# EAGLE schematic generic_midi_1 (EAGLE 6.4)
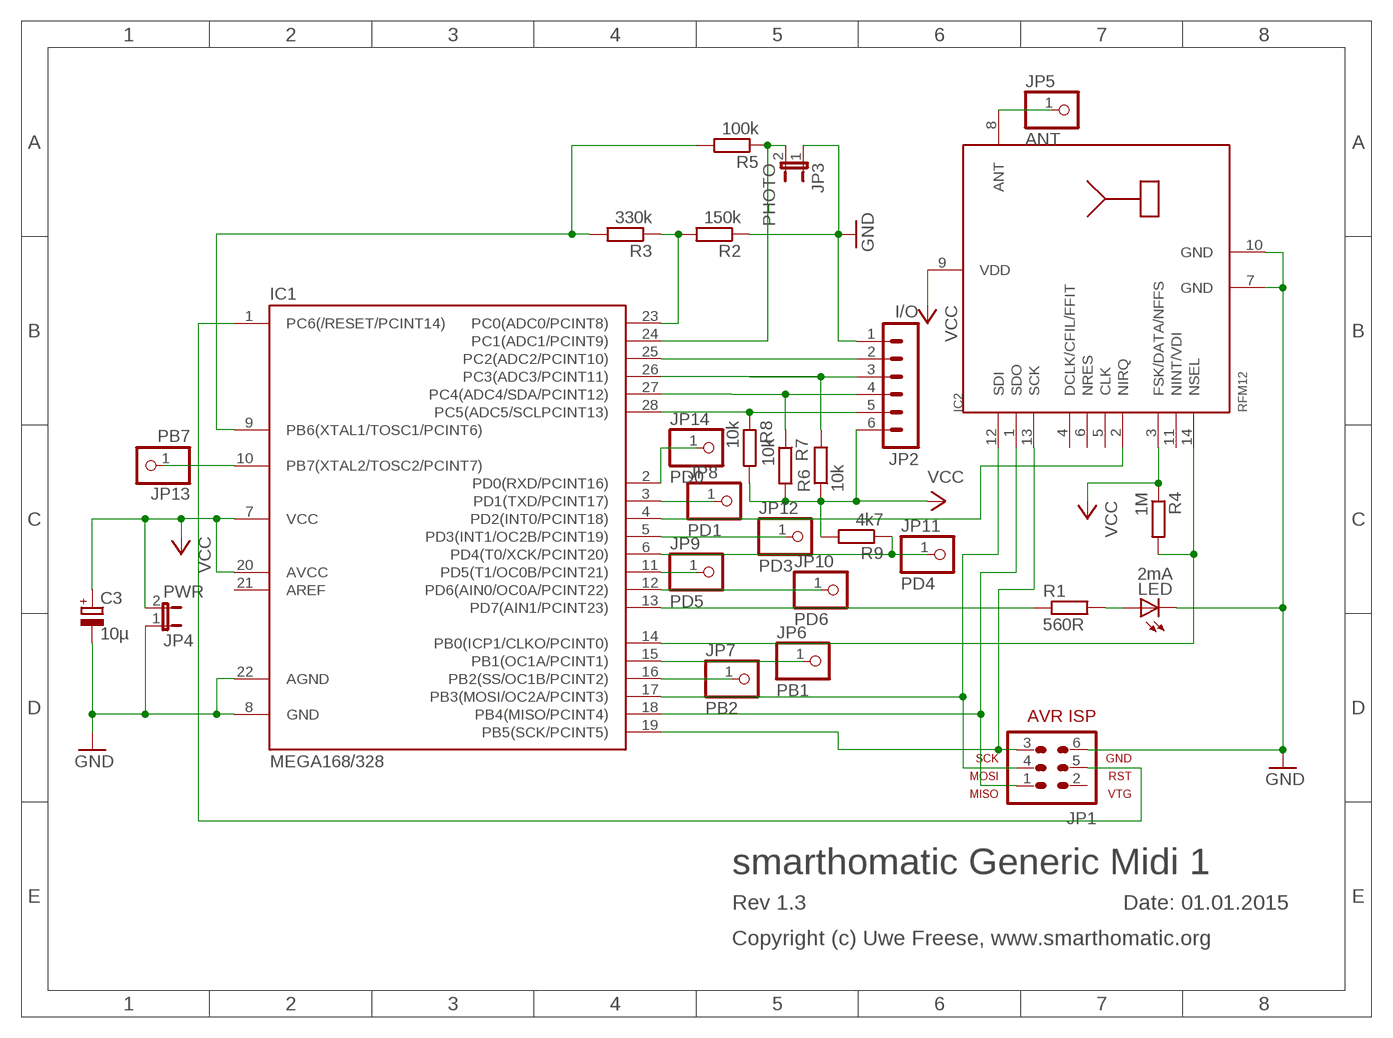
[diagram p0: schematic, sheet 1]

## Parts
C3  10µ  CPOL-EUE1.8-4  [E1,8-4]
IC1  MEGA168/328  MEGA48/88/168-PU  [DIL28-3]
IC2  RFM12  [RFM]
JP1  AVR-ISP-6  [AVR-ISP-6]
JP2  I/O  MA06-1  [MA06-1]
JP3  PHOTO  JP1E  [JP1]
JP4  PWR  JP1E  [JP1]
JP5  ANT  PINHD-1X1  [1X01]
JP6  PB1  PINHD-1X1  [1X01]
JP7  PB2  PINHD-1X1  [1X01]
JP8  PD1  PINHD-1X1  [1X01]
JP9  PD5  PINHD-1X1  [1X01]
JP10  PD6  PINHD-1X1  [1X01]
JP11  PD4  PINHD-1X1  [1X01]
JP12  PD3  PINHD-1X1  [1X01]
JP13  PB7  PINHD-1X1  [1X01]
JP14  PD0  PINHD-1X1  [1X01]
LED  2mA  LED3MM  [LED3MM]
R1  560R  R-EU_0207/7  [0207/7]
R2  150k  R-EU_0207/7  [0207/7]
R3  330k  R-EU_0207/7  [0207/7]
R4  1M  R-EU_0207/7  [0207/7]
R5  100k  R-EU_0207/7  [0207/7]
R6  10k  R-EU_0207/7  [0207/7]
R7  10k  R-EU_0207/7  [0207/7]
R8  10k  R-EU_0207/7  [0207/7]
R9  4k7  R-EU_0207/7  [0207/7]

## Nets
GND: C3.- IC1.8(GND) IC1.22(AGND) IC2.7(GND) IC2.10(GND) JP1.6 JP2.1 JP3.1 JP4.1 LED.K(C) R2.1
N$1: IC1.24(PC1(ADC1/PCINT9)) JP3.2 R5.1
N$3: IC1.17(PB3(MOSI/OC2A/PCINT3)) IC2.12(SDI) JP1.4
N$4: IC1.18(PB4(MISO/PCINT4)) IC2.1(SDO) JP1.1
N$5: IC1.19(PB5(SCK/PCINT5)) IC2.13(SCK) JP1.3
N$6: IC1.13(PD7(AIN1/PCINT23)) R1.1
N$7: IC1.27(PC4(ADC4/SDA/PCINT12)) JP2.4 R7.1
N$8: IC1.1(PC6(/RESET/PCINT14)) JP1.5
N$9: IC1.28(PC5(ADC5/SCLPCINT13)) JP2.5 R8.1
N$10: IC1.26(PC3(ADC3/PCINT11)) JP2.3 R6.2
N$11: IC2.8(ANT) JP5.1
N$12: LED.A R1.2
N$13: IC1.14(PB0(ICP1/CLKO/PCINT0)) IC2.14(NSEL) R4.2
N$14: IC1.11(PD5(T1/OC0B/PCINT21)) JP9.1
N$15: IC1.4(PD2(INT0/PCINT18)) IC2.2(NIRQ)
N$16: IC1.12(PD6(AIN0/OC0A/PCINT22)) JP10.1
N$17: IC1.15(PB1(OC1A/PCINT1)) JP6.1
N$18: IC1.23(PC0(ADC0/PCINT8)) R2.2 R3.1
N$19: IC1.16(PB2(SS/OC1B/PCINT2)) JP7.1
N$20: IC1.3(PD1(TXD/PCINT17)) JP8.1
N$21: IC1.25(PC2(ADC2/PCINT10)) JP2.2
N$22: IC1.6(PD4(T0/XCK/PCINT20)) JP11.1 R9.1
N$23: IC1.5(PD3(INT1/OC2B/PCINT19)) JP12.1
N$24: IC1.9(PB6(XTAL1/TOSC1/PCINT6)) R3.2 R5.2
N$25: IC1.10(PB7(XTAL2/TOSC2/PCINT7)) JP13.1
N$26: IC1.2(PD0(RXD/PCINT16)) JP14.1
VCC: C3.+ IC1.7(VCC) IC1.20(AVCC) IC2.3(FSK/DATA/NFFS) IC2.9(VDD) JP2.6 JP4.2 R4.1 R6.1 R7.2 R8.2 R9.2
Unconnected: IC1.21(AREF) IC2.4(DCLK/CFIL/FFIT) IC2.5(CLK) IC2.6(NRES) IC2.11(NINT/VDI) JP1.2

## Notes on the sheet
- smarthomatic Generic Midi 1
- Rev 1.3 | Date: 01.01.2015
- Copyright (c) Uwe Freese, www.smarthomatic.org

## Library data of the parts
C3 = rcl:CPOL-EU: POLARIZED CAPACITOR, European symbol
IC1 = avr-5-4.16:MEGA48/88/168-PU
IC2 = hopeRF:RFM12
JP1 = avr-5-4.16:AVR-ISP-6: AVR ISP-6 Serial Programming Header
JP2 = con-lstb:MA06-1: PIN HEADER; OC_FARNELL: unknown; OC_NEWARK: unknown
JP3 JP4 = jumper:JP1E: JUMPER
JP5-JP14 = pinhead:PINHD-1X1: PIN HEADER
LED = led:LED: LED OSRAM: - CHIPLED LG R971, LG N971, LY N971, LG Q971, LY Q971, LO R971, LY R971 LH N974, LH R974 LS Q976, LO Q976, LY Q976 LO Q996 - Hyper CHIPLED LW Q18S LB Q993, LB Q99A, LB R99A - SideLED LS A670, LO A670, LY A670, LG A670, LP A670 LB A673, LV A673, LT A673, LW A673 LH A674 LY A675 LS A676, LA A676, LO A676, LY A676, LW A676 LS A679, LY A679, LG A679 - Hyper Micro SIDELED® LS Y876, LA Y876, LO Y876, LY Y876 LT Y87S - SmartLED LW L88C, LW L88S LB L89C, LB L89S, LG L890 LS L89K, LO L89K, LY L89K LS L896, LA L896, LO L896, LY L896 - TOPLED LS T670, LO T670, LY T670, LG T670, LP T670 LSG T670, LSP T670, LSY T670, LOP T670, LYG T670 LG T671, LOG T671, LSG T671 LB T673, LV T673, LT T673, LW T673 LH T674 LS T676, LA T676, LO T676, LY T676, LB T676, LH T676, LSB T676, LW T676 LB T67C, LV T67C, LT T67C, LS T67K, LO T67K, LY T67K, LW E67C LS E67B, LA E67B, LO E67B, LY E67B, LB E67C, LV E67C, LT E67C LW T67C LS T679, LY T679, LG T679 LS T770, LO T770, LY T770, LG T770, LP T770 LB T773, LV T773, LT T773, LW T773 LH T774 LS E675, LA E675, LY E675, LS T675 LS T776, LA T776, LO T776, LY T776, LB T776 LHGB T686 LT T68C, LB T68C - Hyper Mini TOPLED® LB M676 - Mini TOPLED Santana® LG M470 LS M47K, LO M47K, LY M47K Source: http://www.osram.convergy.de LUXEON: - LUMILED® LXK2-PW12-R00, LXK2-PW12-S00, LXK2-PW14-U00, LXK2-PW14-V00 LXK2-PM12-R00, LXK2-PM12-S00, LXK2-PM14-U00 LXK2-PE12-Q00, LXK2-PE12-R00, LXK2-PE12-S00, LXK2-PE14-T00, LXK2-PE14-U00 LXK2-PB12-K00, LXK2-PB12-L00, LXK2-PB12-M00, LXK2-PB14-N00, LXK2-PB14-P00, LXK2-PB14-Q00 LXK2-PR12-L00, LXK2-PR12-M00, LXK2-PR14-Q00, LXK2-PR14-R00 LXK2-PD12-Q00, LXK2-PD12-R00, LXK2-PD12-S00 LXK2-PH12-R00, LXK2-PH12-S00 LXK2-PL12-P00, LXK2-PL12-Q00, LXK2-PL12-R00 Source: www.luxeon.com KINGBRIGHT: KA-3528ASYC Source: www.kingbright.com
R1-R9 = rcl:R-EU_: RESISTOR, European symbol

## Net classes
0 default: clearance 0.305 mm